# EAGLE schematic untitled (EAGLE 8.6.0)
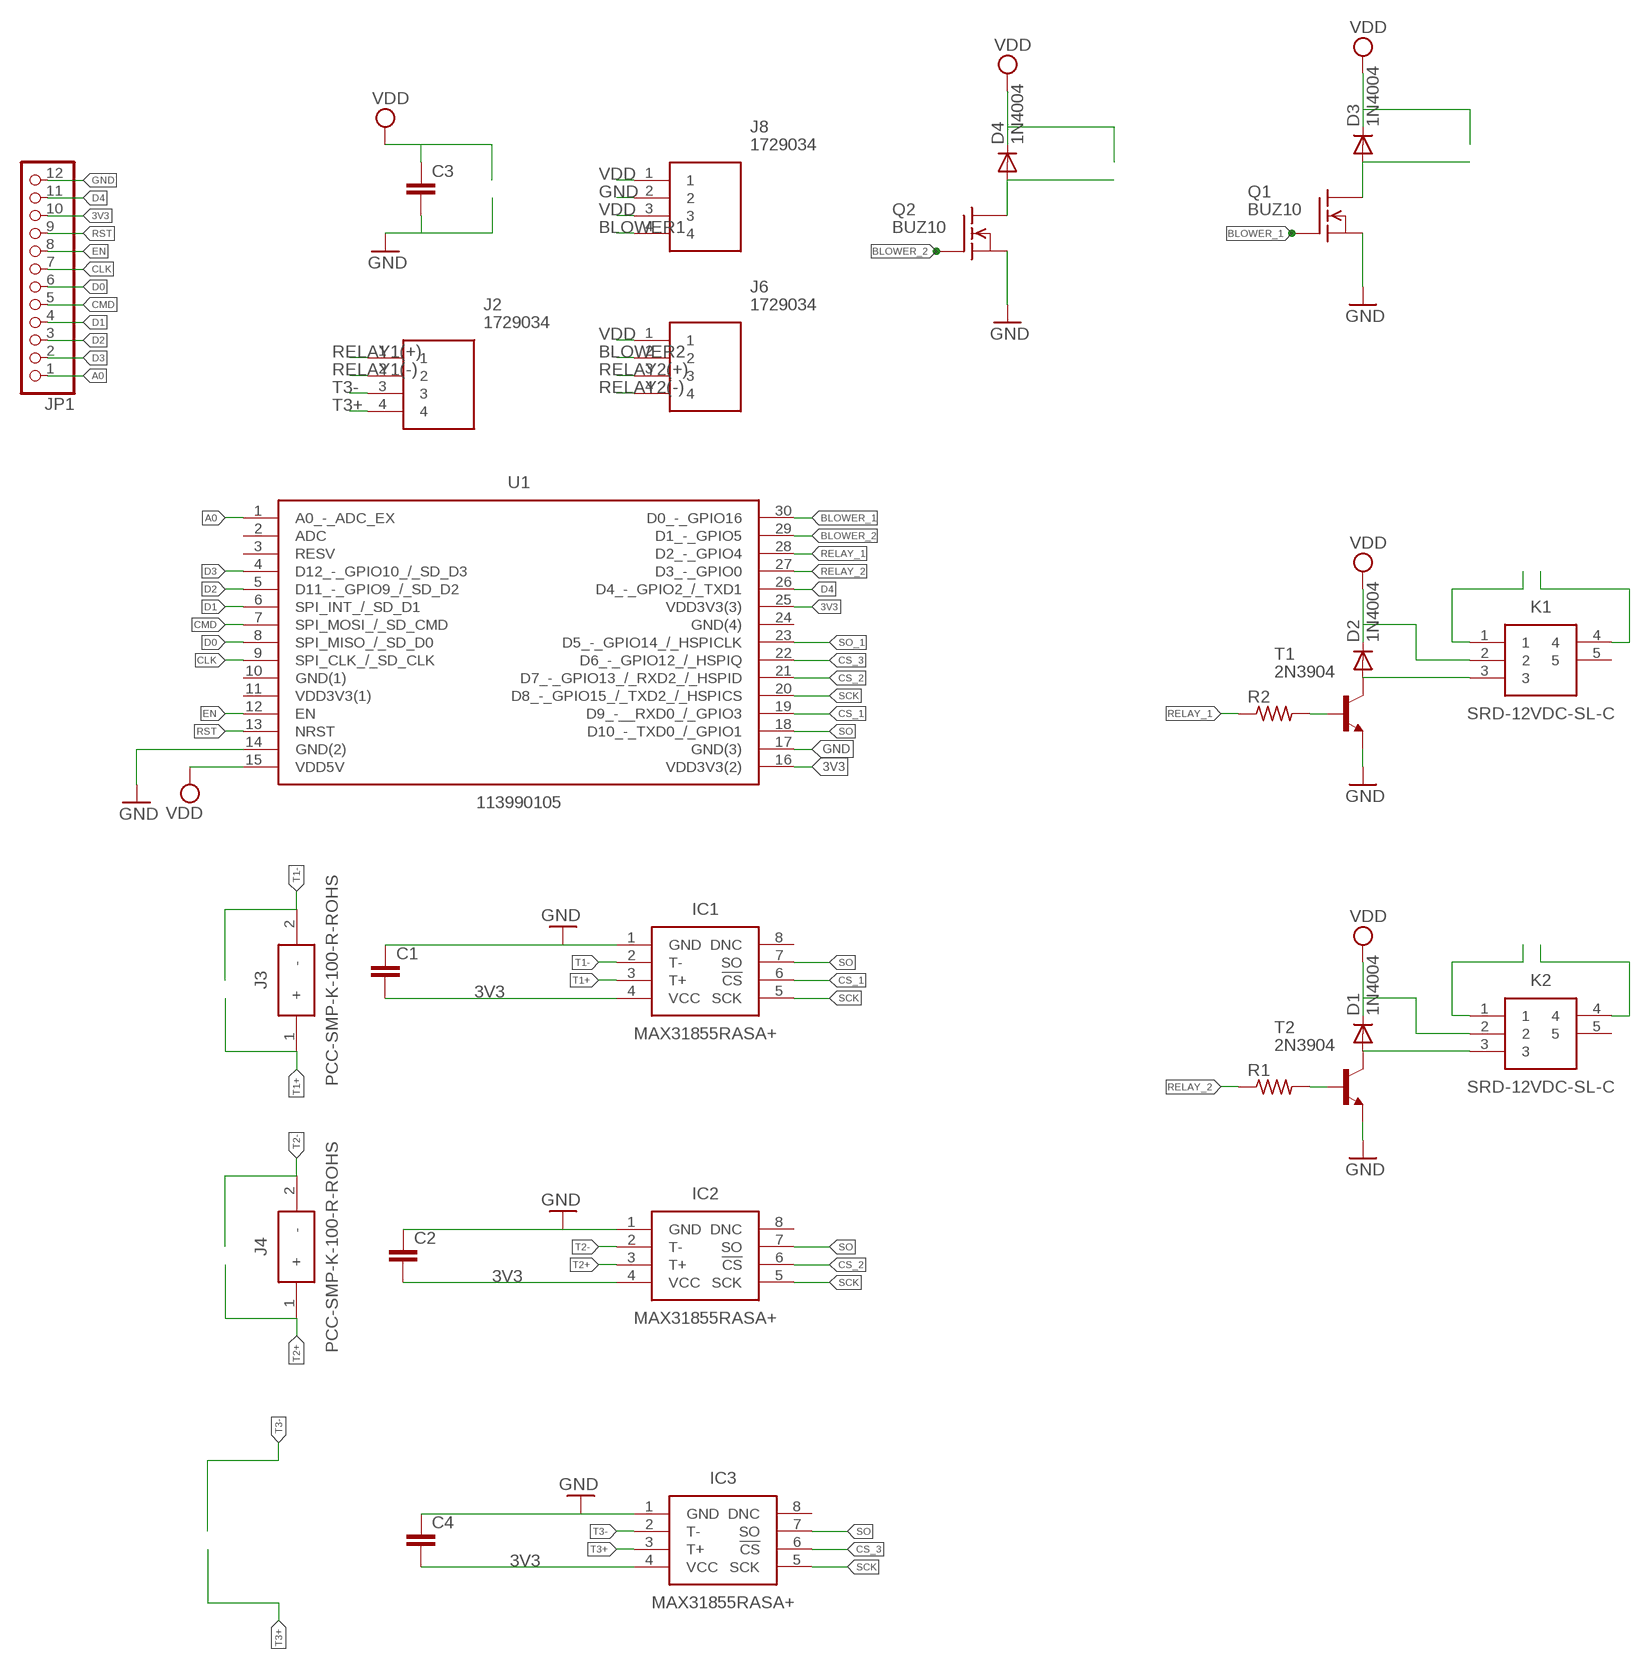
[diagram p0: schematic, sheet 1]

## Parts
C1  C2,5-3  [C2.5-3]
C2  C2,5-3  [C2.5-3]
C3  C2.5/4  [C2.5-4]
C4  C2,5-3  [C2.5-3]
D1  1N4004  [DO41-10]
D2  1N4004  [DO41-10]
D3  1N4004  [DO41-10]
D4  1N4004  [DO41-10]
IC1  MAX31855RASA+  [SOIC127P600X175-8N]
IC2  MAX31855RASA+  [SOIC127P600X175-8N]
IC3  MAX31855RASA+  [SOIC127P600X175-8N]
J2  1729034  [SHDR4W110P0X500_1X4_2000X810X1]
J3  PCC-SMP-K-100-R-ROHS  [PCC-SMP]
J4  PCC-SMP-K-100-R-ROHS  [PCC-SMP]
J6  1729034  [SHDR4W110P0X500_1X4_2000X810X1]
J8  1729034  [SHDR4W110P0X500_1X4_2000X810X1]
JP1  PINHD-1X12  [1X12]
K1  SRD-12VDC-SL-C  [SRD]
K2  SRD-12VDC-SL-C  [SRD]
Q1  BUZ10  [TO220]
Q2  BUZ10  [TO220]
R1  R-US_0207/7  [0207/7]
R2  R-US_0207/7  [0207/7]
T1  2N3904  [TO92]
T2  2N3904  [TO92]
U1  113990105  [DIP2286W64P254L4826H735Q30N]

## Nets
3V3: C1.2 C2.2 C4.2 IC1.4(VCC) IC2.4(VCC) IC3.4(VCC) JP1.10 U1.16(VDD3V3(2)) U1.25(VDD3V3(3))
A0: JP1.1 U1.1(A0_-_ADC_EX)
BLOWER1: D3.A J8.4 Q1.2(D)
BLOWER2: D4.A J6.2 Q2.2(D)
BLOWER_1: Q1.1(G) U1.30(D0_-_GPIO16)
BLOWER_2: Q2.1(G) U1.29(D1_-_GPIO5)
CLK: JP1.7 U1.9(SPI_CLK_/_SD_CLK)
CMD: JP1.5 U1.7(SPI_MOSI_/_SD_CMD)
CS_1: IC1.6(!CS) U1.19(D9_-__RXD0_/_GPIO3)
CS_2: IC2.6(!CS) U1.21(D7_-_GPIO13_/_RXD2_/_HSPID)
CS_3: IC3.6(!CS) U1.22(D6_-_GPIO12_/_HSPIQ)
D0: JP1.6 U1.8(SPI_MISO_/_SD_D0)
D1: JP1.4 U1.6(SPI_INT_/_SD_D1)
D2: JP1.3 U1.5(D11_-_GPIO9_/_SD_D2)
D3: JP1.2 U1.4(D12_-_GPIO10_/_SD_D3)
D4: JP1.11 U1.26(D4_-_GPIO2_/_TXD1)
EN: JP1.8 U1.12(EN)
GND: C1.1 C2.1 C3.2 C4.1 IC1.1(GND) IC2.1(GND) IC3.1(GND) J8.2 JP1.12 Q1.3(S) Q2.3(S) T1.3(E) T2.3(E) U1.14(GND(2)) U1.17(GND(3))
N$1: R1.2 T2.2(B)
N$2: D1.A K2.3 T2.1(C)
N$3: R2.2 T1.2(B)
N$8: D2.A K1.3 T1.1(C)
RELAY1(+) [POWER]: J2.1 K1.4
RELAY1(-) [POWER]: J2.2 K1.1
RELAY2(+) [POWER]: J6.3 K2.4
RELAY2(-) [POWER]: J6.4 K2.1
RELAY_1: R2.1 U1.28(D2_-_GPIO4)
RELAY_2: R1.1 U1.27(D3_-_GPIO0)
RST: JP1.9 U1.13(NRST)
SCK: IC1.5(SCK) IC2.5(SCK) IC3.5(SCK) U1.20(D8_-_GPIO15_/_TXD2_/_HSPICS)
SO: IC1.7(SO) IC2.7(SO) IC3.7(SO) U1.18(D10_-_TXD0_/_GPIO1)
SO_1: U1.23(D5_-_GPIO14_/_HSPICLK)
T1+: IC1.3(T+) J3.1(+)
T1-: IC1.2(T-) J3.2(-)
T2+: IC2.3(T+) J4.1(+)
T2-: IC2.2(T-) J4.2(-)
T3+: IC3.3(T+) J2.4
T3-: IC3.2(T-) J2.3
VDD: C3.1 D1.C D2.C D3.C D4.C J6.1 J8.1 J8.3 K1.2 K2.2 U1.15(VDD5V)
Unconnected: IC1.8(DNC) IC2.8(DNC) IC3.8(DNC) K1.5 K2.5 U1.2(ADC) U1.3(RESV)

## Power pins joined to a net without a drawn wire
GND(1): U1.10(GND(1))
GND(4): U1.24(GND(4))
VDD3V3(1): U1.11(VDD3V3(1))

## Library data of the parts
C1-C4 = capacitor-wima:C: CAPACITOR naming: grid - package width
D1-D4 = adafruit:1N4004: DIODE General purpose 1N400x type rectifier (With bigger pads) http://www.ladyada.net/library/pcb/eaglelibrary.html
IC1-IC3 = MAX31855RASA+:MAX31855RASA+: Thermocouple-to-Digital, type R SOIC8 Maxim MAX31855RASA+, Thermocouple Amplifier, 3.3 V, 8-Pin SOIC <https://componentsearchengine.com/Images/3/MAX31855RASA%2B.jpg> Source: Datasheet <https://datasheets.maximintegrated.com/en/ds/MAX31855.pdf>; DESCRIPTION: Thermocouple-to-Digital, type R SOIC8 Maxim MAX31855RASA+, Thermocouple Amplifier, 3.3 V, 8-Pin SOIC; HEIGHT: 1.75mm; MANUFACTURER_NAME: Maxim Integrated; MANUFACTURER_PART_NUMBER: MAX31855RASA+; RS_PART_NUMBER: 7833891P; SUPPLIER_NAME: RS
J2 J6 J8 = 1729034:1729034: Low profile PCB terminal block,5mm,4 way Phoenix Contact COMBICON MKDSN Series 5mm Pitch Straight PCB Terminal Block with Screw Termination, Through Hole, 4 Way Source: Datasheet <http://uk.rs-online.com/web/p/products/8020620>; ALLIED_NUMBER: 70054377; DESCRIPTION: Low profile PCB terminal block,5mm,4 way Phoenix Contact COMBICON MKDSN Series 5mm Pitch Straight PCB Terminal Block with Screw Termination, Through Hole, 4 Way; HEIGHT: 10mm; MANUFACTURER_NAME: Phoenix Contact; MANUFACTURER_PART_NUMBER: 1729034; RS_PART_NUMBER: 8020620
J3 J4 = PCC-SMP-K-100-R-ROHS:PCC-SMP-K-100-R-ROHS: NEWPORT ELECTRONICS - PCC-SMP-K-100-R-ROHS - CIRCUIT BOARD THERMOCOUPLE, K TYPE Source: Datasheet <http://www.farnell.com/datasheets/1789660.pdf>; DESCRIPTION: NEWPORT ELECTRONICS - PCC-SMP-K-100-R-ROHS - CIRCUIT BOARD THERMOCOUPLE, K TYPE; HEIGHT: mm; MANUFACTURER_NAME: NEWPORT ELECTRONICS; MANUFACTURER_PART_NUMBER: PCC-SMP-K-100-R-ROHS; SUPPLIER_NAME: RS
JP1 = adafruit:PINHD-1X12: PIN HEADER
K1 K2 = SRD-12VDC-SL-C:SRD-12VDC-SL-C: SRD Relay, ISO9002, 10A Switching Cap. Sealed Type, 0.36W, 1 Form C Source: Datasheet <http://www.songle.com/en/pdf/20084141716341001.pdf>; DESCRIPTION: SRD Relay, ISO9002, 10A Switching Cap. Sealed Type, 0.36W, 1 Form C; HEIGHT: mm; MANUFACTURER_NAME: Songle Relay; MANUFACTURER_PART_NUMBER: SRD-12VDC-SL-C; SUPPLIER_NAME: RS
Q1 Q2 = transistor-fet:BUZ10: N-Channel Enhancement MOSFET 50V; 20A; 0,080Ohm
R1 R2 = resistor:R-US_: RESISTOR, American symbol
T1 T2 = transistor:2N3904: NPN TRANSISTOR
U1 = 113990105:113990105: NodeMCU DEVKIT V1.0 <https://componentsearchengine.com/Images/1/113990105.jpg> Source: Datasheet <https://github.com/nodemcu/nodemcu-devkit-v1.0/blob/master/NODEMCU_DEVKIT_V1.0.PDF>; DESCRIPTION: NodeMCU DEVKIT V1.0; HEIGHT: 7.35mm; MANUFACTURER_NAME: Seeed Studio; MANUFACTURER_PART_NUMBER: 113990105; SUPPLIER_NAME: RS

## Net classes
0 default: width 2.54 mm, clearance 0.381 mm
1 POWER: width 5.08 mm, clearance 0.381 mm